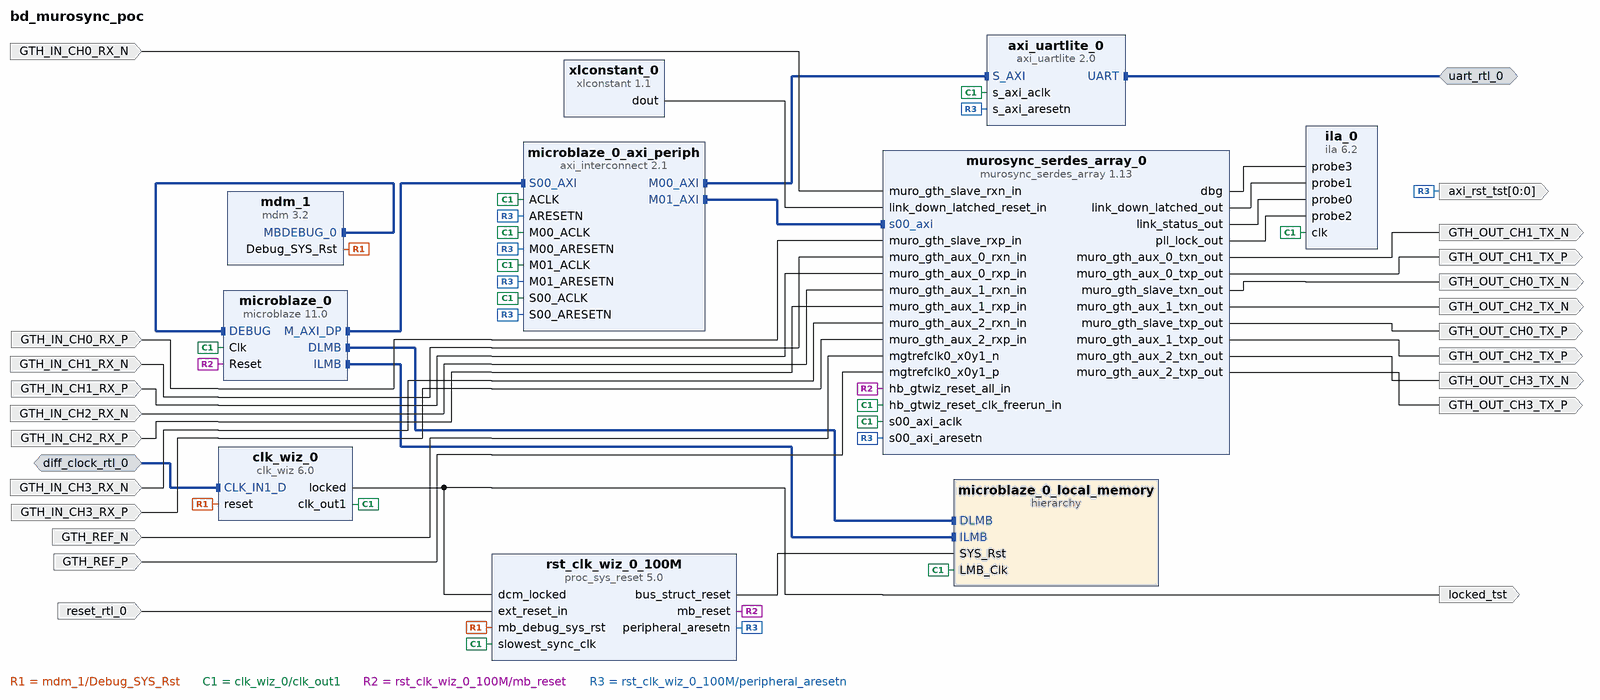
[diagram p0: block diagram of the top level]
# Vivado block design bd_murosync_poc, xcau15p-ffvb676-2-i, Vivado 2022.2
create_bd_design bd_murosync_poc

create_bd_intf_port -mode Master -vlnv xilinx.com:interface:uart_rtl:1.0 uart_rtl_0
create_bd_intf_port -mode Slave -vlnv xilinx.com:interface:diff_clock_rtl:1.0 diff_clock_rtl_0
set_property -dict {CONFIG.FREQ_HZ 200000000} [get_bd_intf_ports diff_clock_rtl_0]
create_bd_port -dir I -type rst reset_rtl_0
set_property -dict {CONFIG.POLARITY ACTIVE_LOW} [get_bd_ports reset_rtl_0]
create_bd_port -dir O locked_tst
create_bd_port -dir O -from 0 -to 0 axi_rst_tst
create_bd_port -dir I GTH_REF_P
create_bd_port -dir I GTH_REF_N
create_bd_port -dir I GTH_IN_CH0_RX_N
create_bd_port -dir I GTH_IN_CH0_RX_P
create_bd_port -dir I GTH_IN_CH1_RX_N
create_bd_port -dir I GTH_IN_CH1_RX_P
create_bd_port -dir I GTH_IN_CH2_RX_N
create_bd_port -dir I GTH_IN_CH2_RX_P
create_bd_port -dir I GTH_IN_CH3_RX_N
create_bd_port -dir I GTH_IN_CH3_RX_P
create_bd_port -dir O GTH_OUT_CH0_TX_N
create_bd_port -dir O GTH_OUT_CH0_TX_P
create_bd_port -dir O GTH_OUT_CH1_TX_N
create_bd_port -dir O GTH_OUT_CH1_TX_P
create_bd_port -dir O GTH_OUT_CH2_TX_N
create_bd_port -dir O GTH_OUT_CH2_TX_P
create_bd_port -dir O GTH_OUT_CH3_TX_N
create_bd_port -dir O GTH_OUT_CH3_TX_P

create_bd_cell -type ip -vlnv xilinx.com:ip:microblaze:11.0 microblaze_0
set_property -dict {CONFIG.C_DEBUG_ENABLED 1 CONFIG.C_D_AXI 1 CONFIG.C_D_LMB 1 CONFIG.C_I_LMB 1} [get_bd_cells microblaze_0]
create_bd_cell -type ip -vlnv xilinx.com:ip:axi_uartlite:2.0 axi_uartlite_0
create_bd_cell -type ip -vlnv xilinx.com:ip:clk_wiz:6.0 clk_wiz_0
set_property -dict [list \
  CONFIG.CLKIN1_JITTER_PS 50.0 \
  CONFIG.CLKOUT1_JITTER 92.799 \
  CONFIG.CLKOUT1_PHASE_ERROR 82.655 \
  CONFIG.CLKOUT1_REQUESTED_OUT_FREQ 200 \
  CONFIG.MMCM_CLKFBOUT_MULT_F 6.000 \
  CONFIG.MMCM_CLKIN1_PERIOD 5.000 \
  CONFIG.MMCM_CLKIN2_PERIOD 10.0 \
  CONFIG.MMCM_CLKOUT0_DIVIDE_F 6.000 \
  CONFIG.PRIM_IN_FREQ 200 \
  CONFIG.PRIM_SOURCE Differential_clock_capable_pin \
] [get_bd_cells clk_wiz_0]
create_bd_cell -type hier microblaze_0_local_memory
create_bd_cell -type ip -vlnv xilinx.com:ip:mdm:3.2 mdm_1
create_bd_cell -type ip -vlnv xilinx.com:ip:proc_sys_reset:5.0 rst_clk_wiz_0_100M
create_bd_cell -type ip -vlnv xilinx.com:ip:axi_interconnect:2.1 microblaze_0_axi_periph
set_property -dict {CONFIG.NUM_MI 2 CONFIG.NUM_SI 1} [get_bd_cells microblaze_0_axi_periph]
create_bd_cell -type ip -vlnv xilinx.com:ip:ila:6.2 ila_0
set_property -dict {CONFIG.C_MONITOR_TYPE Native CONFIG.C_NUM_OF_PROBES 4 CONFIG.C_PROBE3_WIDTH 64} [get_bd_cells ila_0]
create_bd_cell -type ip -vlnv xilinx.com:ip:xlconstant:1.1 xlconstant_0
set_property -dict {CONFIG.CONST_VAL 0 CONFIG.CONST_WIDTH 1} [get_bd_cells xlconstant_0]
create_bd_cell -type ip -vlnv xilinx.com:user:murosync_serdes_array:1.13 murosync_serdes_array_0
set_property -dict {CONFIG.MODE SLAVE} [get_bd_cells murosync_serdes_array_0]

# ---- hierarchy /microblaze_0_local_memory ----
current_bd_instance /microblaze_0_local_memory
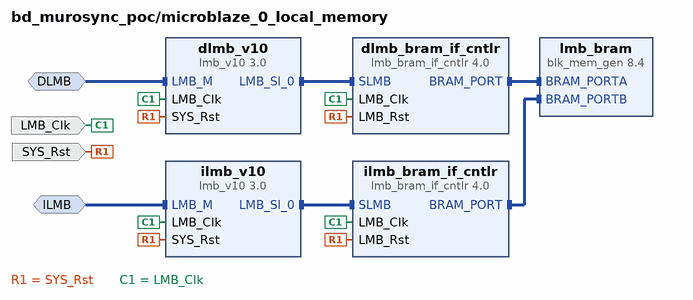
[diagram p1: block diagram inside /microblaze_0_local_memory]
create_bd_intf_pin -mode MirroredMaster -vlnv xilinx.com:interface:lmb_rtl:1.0 DLMB
create_bd_intf_pin -mode MirroredMaster -vlnv xilinx.com:interface:lmb_rtl:1.0 ILMB
create_bd_pin -dir I -type clk LMB_Clk
create_bd_pin -dir I -type rst SYS_Rst

create_bd_cell -type ip -vlnv xilinx.com:ip:lmb_v10:3.0 dlmb_v10
create_bd_cell -type ip -vlnv xilinx.com:ip:lmb_v10:3.0 ilmb_v10
create_bd_cell -type ip -vlnv xilinx.com:ip:lmb_bram_if_cntlr:4.0 dlmb_bram_if_cntlr
set_property -dict {CONFIG.C_ECC 0} [get_bd_cells dlmb_bram_if_cntlr]
create_bd_cell -type ip -vlnv xilinx.com:ip:lmb_bram_if_cntlr:4.0 ilmb_bram_if_cntlr
set_property -dict {CONFIG.C_ECC 0} [get_bd_cells ilmb_bram_if_cntlr]
create_bd_cell -type ip -vlnv xilinx.com:ip:blk_mem_gen:8.4 lmb_bram
set_property -dict {CONFIG.Memory_Type True_Dual_Port_RAM CONFIG.use_bram_block BRAM_Controller} [get_bd_cells lmb_bram]

# ---- connections ----

current_bd_instance /microblaze_0_local_memory
connect_bd_intf_net -intf_net microblaze_0_dlmb [get_bd_intf_pins DLMB] [get_bd_intf_pins dlmb_v10/LMB_M]
connect_bd_intf_net -intf_net microblaze_0_dlmb_bus [get_bd_intf_pins dlmb_v10/LMB_Sl_0] [get_bd_intf_pins dlmb_bram_if_cntlr/SLMB]
connect_bd_intf_net -intf_net microblaze_0_dlmb_cntlr [get_bd_intf_pins dlmb_bram_if_cntlr/BRAM_PORT] [get_bd_intf_pins lmb_bram/BRAM_PORTA]
connect_bd_intf_net -intf_net microblaze_0_ilmb [get_bd_intf_pins ILMB] [get_bd_intf_pins ilmb_v10/LMB_M]
connect_bd_intf_net -intf_net microblaze_0_ilmb_bus [get_bd_intf_pins ilmb_v10/LMB_Sl_0] [get_bd_intf_pins ilmb_bram_if_cntlr/SLMB]
connect_bd_intf_net -intf_net microblaze_0_ilmb_cntlr [get_bd_intf_pins ilmb_bram_if_cntlr/BRAM_PORT] [get_bd_intf_pins lmb_bram/BRAM_PORTB]
connect_bd_net [get_bd_pins SYS_Rst] \
  [get_bd_pins dlmb_v10/SYS_Rst] [get_bd_pins dlmb_bram_if_cntlr/LMB_Rst] [get_bd_pins ilmb_v10/SYS_Rst] \
  [get_bd_pins ilmb_bram_if_cntlr/LMB_Rst]
connect_bd_net -net microblaze_0_Clk [get_bd_pins LMB_Clk] \
  [get_bd_pins dlmb_v10/LMB_Clk] [get_bd_pins dlmb_bram_if_cntlr/LMB_Clk] [get_bd_pins ilmb_v10/LMB_Clk] \
  [get_bd_pins ilmb_bram_if_cntlr/LMB_Clk]
set_property HDL_ATTRIBUTE.BMM_INFO_ADDRESS_SPACE {byte  0x00000000 32 > bd_murosync_poc microblaze_0_local_memory/lmb_bram} [get_bd_cells dlmb_bram_if_cntlr]
set_property HDL_ATTRIBUTE.KEEP_HIERARCHY yes [get_bd_cells dlmb_bram_if_cntlr]

current_bd_instance /
connect_bd_intf_net [get_bd_intf_ports uart_rtl_0] [get_bd_intf_pins axi_uartlite_0/UART]
connect_bd_intf_net -intf_net diff_clock_rtl_0_1 [get_bd_intf_ports diff_clock_rtl_0] [get_bd_intf_pins clk_wiz_0/CLK_IN1_D]
connect_bd_intf_net [get_bd_intf_pins microblaze_0/M_AXI_DP] [get_bd_intf_pins microblaze_0_axi_periph/S00_AXI]
connect_bd_intf_net [get_bd_intf_pins microblaze_0_axi_periph/M00_AXI] [get_bd_intf_pins axi_uartlite_0/S_AXI]
connect_bd_intf_net [get_bd_intf_pins microblaze_0_axi_periph/M01_AXI] [get_bd_intf_pins murosync_serdes_array_0/s00_axi]
connect_bd_intf_net [get_bd_intf_pins mdm_1/MBDEBUG_0] [get_bd_intf_pins microblaze_0/DEBUG]
connect_bd_intf_net [get_bd_intf_pins microblaze_0/DLMB] [get_bd_intf_pins microblaze_0_local_memory/DLMB]
connect_bd_intf_net [get_bd_intf_pins microblaze_0/ILMB] [get_bd_intf_pins microblaze_0_local_memory/ILMB]
connect_bd_net [get_bd_ports GTH_IN_CH0_RX_N] [get_bd_pins murosync_serdes_array_0/muro_gth_slave_rxn_in]
connect_bd_net [get_bd_ports GTH_IN_CH0_RX_P] [get_bd_pins murosync_serdes_array_0/muro_gth_slave_rxp_in]
connect_bd_net [get_bd_ports GTH_IN_CH1_RX_N] [get_bd_pins murosync_serdes_array_0/muro_gth_aux_0_rxn_in]
connect_bd_net [get_bd_ports GTH_IN_CH1_RX_P] [get_bd_pins murosync_serdes_array_0/muro_gth_aux_0_rxp_in]
connect_bd_net [get_bd_ports GTH_IN_CH2_RX_N] [get_bd_pins murosync_serdes_array_0/muro_gth_aux_1_rxn_in]
connect_bd_net [get_bd_ports GTH_IN_CH2_RX_P] [get_bd_pins murosync_serdes_array_0/muro_gth_aux_1_rxp_in]
connect_bd_net [get_bd_ports GTH_IN_CH3_RX_N] [get_bd_pins murosync_serdes_array_0/muro_gth_aux_2_rxn_in]
connect_bd_net [get_bd_ports GTH_IN_CH3_RX_P] [get_bd_pins murosync_serdes_array_0/muro_gth_aux_2_rxp_in]
connect_bd_net [get_bd_ports GTH_REF_N] [get_bd_pins murosync_serdes_array_0/mgtrefclk0_x0y1_n]
connect_bd_net [get_bd_ports GTH_REF_P] [get_bd_pins murosync_serdes_array_0/mgtrefclk0_x0y1_p]
connect_bd_net [get_bd_pins clk_wiz_0/locked] [get_bd_pins rst_clk_wiz_0_100M/dcm_locked] [get_bd_ports locked_tst]
connect_bd_net [get_bd_pins mdm_1/Debug_SYS_Rst] [get_bd_pins rst_clk_wiz_0_100M/mb_debug_sys_rst] [get_bd_pins clk_wiz_0/reset]
connect_bd_net -net microblaze_0_Clk [get_bd_pins clk_wiz_0/clk_out1] \
  [get_bd_pins microblaze_0/Clk] [get_bd_pins microblaze_0_local_memory/LMB_Clk] \
  [get_bd_pins rst_clk_wiz_0_100M/slowest_sync_clk] [get_bd_pins microblaze_0_axi_periph/S00_ACLK] \
  [get_bd_pins axi_uartlite_0/s_axi_aclk] [get_bd_pins microblaze_0_axi_periph/M00_ACLK] \
  [get_bd_pins microblaze_0_axi_periph/ACLK] [get_bd_pins ila_0/clk] [get_bd_pins microblaze_0_axi_periph/M01_ACLK] \
  [get_bd_pins murosync_serdes_array_0/hb_gtwiz_reset_clk_freerun_in] [get_bd_pins murosync_serdes_array_0/s00_axi_aclk]
connect_bd_net [get_bd_pins murosync_serdes_array_0/dbg] [get_bd_pins ila_0/probe3]
connect_bd_net [get_bd_pins murosync_serdes_array_0/link_down_latched_out] [get_bd_pins ila_0/probe1]
connect_bd_net [get_bd_pins murosync_serdes_array_0/link_status_out] [get_bd_pins ila_0/probe0]
connect_bd_net [get_bd_pins murosync_serdes_array_0/muro_gth_aux_0_txn_out] [get_bd_ports GTH_OUT_CH1_TX_N]
connect_bd_net [get_bd_pins murosync_serdes_array_0/muro_gth_aux_0_txp_out] [get_bd_ports GTH_OUT_CH1_TX_P]
connect_bd_net [get_bd_pins murosync_serdes_array_0/muro_gth_aux_1_txn_out] [get_bd_ports GTH_OUT_CH2_TX_N]
connect_bd_net [get_bd_pins murosync_serdes_array_0/muro_gth_aux_1_txp_out] [get_bd_ports GTH_OUT_CH2_TX_P]
connect_bd_net [get_bd_pins murosync_serdes_array_0/muro_gth_aux_2_txn_out] [get_bd_ports GTH_OUT_CH3_TX_N]
connect_bd_net [get_bd_pins murosync_serdes_array_0/muro_gth_aux_2_txp_out] [get_bd_ports GTH_OUT_CH3_TX_P]
connect_bd_net [get_bd_pins murosync_serdes_array_0/muro_gth_slave_txn_out] [get_bd_ports GTH_OUT_CH0_TX_N]
connect_bd_net [get_bd_pins murosync_serdes_array_0/muro_gth_slave_txp_out] [get_bd_ports GTH_OUT_CH0_TX_P]
connect_bd_net [get_bd_pins murosync_serdes_array_0/pll_lock_out] [get_bd_pins ila_0/probe2]
connect_bd_net -net reset_rtl_0_1 [get_bd_ports reset_rtl_0] [get_bd_pins rst_clk_wiz_0_100M/ext_reset_in]
connect_bd_net [get_bd_pins rst_clk_wiz_0_100M/bus_struct_reset] [get_bd_pins microblaze_0_local_memory/SYS_Rst]
connect_bd_net [get_bd_pins rst_clk_wiz_0_100M/mb_reset] [get_bd_pins microblaze_0/Reset] [get_bd_pins murosync_serdes_array_0/hb_gtwiz_reset_all_in]
connect_bd_net [get_bd_pins rst_clk_wiz_0_100M/peripheral_aresetn] \
  [get_bd_pins microblaze_0_axi_periph/S00_ARESETN] [get_bd_pins axi_uartlite_0/s_axi_aresetn] \
  [get_bd_pins microblaze_0_axi_periph/M00_ARESETN] [get_bd_pins microblaze_0_axi_periph/ARESETN] [get_bd_ports axi_rst_tst] \
  [get_bd_pins microblaze_0_axi_periph/M01_ARESETN] [get_bd_pins murosync_serdes_array_0/s00_axi_aresetn]
connect_bd_net [get_bd_pins xlconstant_0/dout] [get_bd_pins murosync_serdes_array_0/link_down_latched_reset_in]
set_property HDL_ATTRIBUTE.BMM_INFO_PROCESSOR {microblaze-le > bd_murosync_poc microblaze_0_local_memory/dlmb_bram_if_cntlr} [get_bd_cells microblaze_0]
set_property HDL_ATTRIBUTE.KEEP_HIERARCHY yes [get_bd_cells microblaze_0]

# ---- address map ----
assign_bd_address -offset 0x00000000 -range 64K -target_address_space [get_bd_addr_spaces microblaze_0/Data] [get_bd_addr_segs microblaze_0_local_memory/dlmb_bram_if_cntlr/SLMB/Mem]
assign_bd_address -offset 0x00010000 -range 4K -target_address_space [get_bd_addr_spaces microblaze_0/Data] [get_bd_addr_segs murosync_serdes_array_0/s00_axi/reg0]
assign_bd_address -offset 0x40600000 -range 4K -target_address_space [get_bd_addr_spaces microblaze_0/Data] [get_bd_addr_segs axi_uartlite_0/S_AXI/Reg]
assign_bd_address -offset 0x00000000 -range 64K -target_address_space [get_bd_addr_spaces microblaze_0/Instruction] [get_bd_addr_segs microblaze_0_local_memory/ilmb_bram_if_cntlr/SLMB/Mem]

validate_bd_design
save_bd_design
